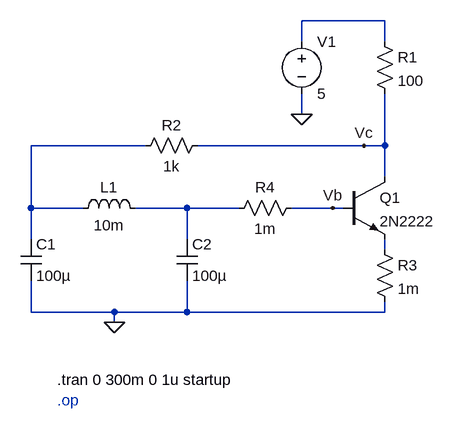
[diagram p0: schematic hp10811.asc]
hp10811.asc, the LTspice schematic file:
Version 4
SHEET 1 880 680
WIRE 592 -256 464 -256
WIRE 464 -224 464 -256
WIRE 592 -224 592 -256
WIRE 464 -112 464 -144
WIRE 224 -64 48 -64
WIRE 560 -64 304 -64
WIRE 592 -64 592 -144
WIRE 592 -64 560 -64
WIRE 592 -16 592 -64
WIRE 48 32 48 -64
WIRE 128 32 48 32
WIRE 288 32 208 32
WIRE 368 32 288 32
WIRE 512 32 448 32
WIRE 528 32 512 32
WIRE 48 80 48 32
WIRE 288 80 288 32
WIRE 592 96 592 80
WIRE 48 192 48 144
WIRE 176 192 48 192
WIRE 288 192 288 144
WIRE 288 192 176 192
WIRE 592 192 592 176
WIRE 592 192 288 192
WIRE 176 208 176 192
FLAG 176 208 0
FLAG 464 -112 0
FLAG 512 32 Vb
FLAG 560 -64 Vc
SYMBOL cap 32 80 R0
SYMATTR InstName C1
SYMATTR Value 100µ
SYMBOL cap 272 80 R0
SYMATTR InstName C2
SYMATTR Value 100µ
SYMBOL ind 112 48 R270
WINDOW 0 32 56 VTop 2
WINDOW 3 5 56 VBottom 2
SYMATTR InstName L1
SYMATTR Value 10m
SYMBOL npn 528 -16 R0
SYMATTR InstName Q1
SYMATTR Value 2N2222
SYMBOL res 576 -240 R0
SYMATTR InstName R1
SYMATTR Value 100
SYMBOL voltage 464 -240 R0
WINDOW 123 0 0 Left 0
WINDOW 39 0 0 Left 0
SYMATTR InstName V1
SYMATTR Value 5
SYMBOL res 320 -80 R90
WINDOW 0 0 56 VBottom 2
WINDOW 3 32 56 VTop 2
SYMATTR InstName R2
SYMATTR Value 1k
SYMBOL res 576 80 R0
SYMATTR InstName R3
SYMATTR Value 1m
SYMBOL res 352 48 R270
WINDOW 0 32 56 VTop 2
WINDOW 3 0 56 VBottom 2
SYMATTR InstName R4
SYMATTR Value 1m
TEXT 88 296 Left 2 !.tran 0 300m 0 1u startup
TEXT 88 328 Left 2 ;.op

The netlist it stands for:
* hp10811.asc
C1 N002 0 100µ
C2 N003 0 100µ
L1 N002 N003 10m
Q1 Vc Vb N004 0 2N2222
R1 N001 Vc 100
V1 N001 0 5
R2 Vc N002 1k
R3 N004 0 1m
R4 N003 Vb 1m
.model NPN NPN
.model PNP PNP
.lib standard.bjt
.tran 0 300m 0 1u startup
* .op
.backanno
.end